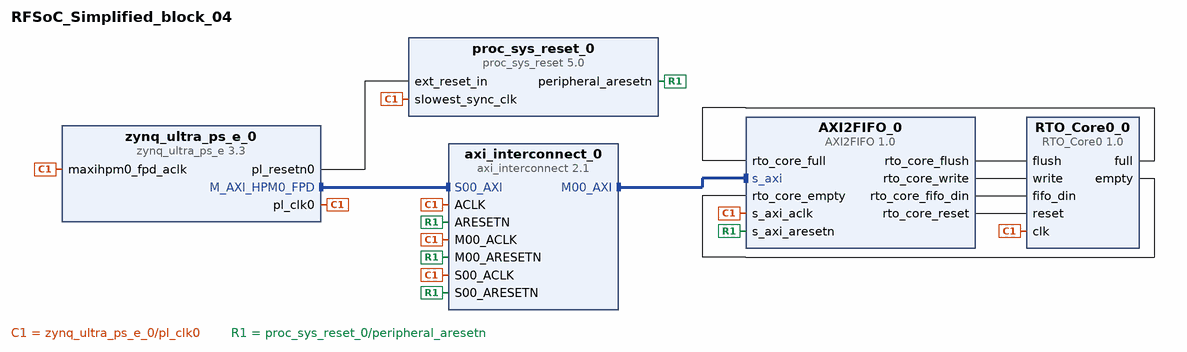
[diagram p0: block diagram of the top level]
# Vivado block design RFSoC_Simplified_block_04, xczu28dr-ffvg1517-2-e, Vivado 2020.2
create_bd_design RFSoC_Simplified_block_04

create_bd_cell -type ip -vlnv xilinx.com:ip:zynq_ultra_ps_e:3.3 zynq_ultra_ps_e_0
set_property -dict [list \
  CONFIG.PSU__DDR_HIGH_ADDRESS_GUI_ENABLE 0 \
  CONFIG.PSU__MAXIGP0__DATA_WIDTH 128 \
  CONFIG.PSU__USE__M_AXI_GP0 1 \
  CONFIG.PSU__USE__M_AXI_GP2 0 \
] [get_bd_cells zynq_ultra_ps_e_0]
# 2 more settings of zynq_ultra_ps_e_0 are not shown: defaults, MIO pin electricals, DDR timing, and values the tool derives
create_bd_cell -type ip -vlnv xilinx.com:ip:axi_interconnect:2.1 axi_interconnect_0
set_property -dict {CONFIG.NUM_MI 1} [get_bd_cells axi_interconnect_0]
create_bd_cell -type ip -vlnv xilinx.com:ip:proc_sys_reset:5.0 proc_sys_reset_0
create_bd_cell -type ip -vlnv xilinx.com:user:AXI2FIFO:1.0 AXI2FIFO_0
create_bd_cell -type ip -vlnv xilinx.com:user:RTO_Core0:1.0 RTO_Core0_0

# ---- connections ----

connect_bd_intf_net [get_bd_intf_pins zynq_ultra_ps_e_0/M_AXI_HPM0_FPD] [get_bd_intf_pins axi_interconnect_0/S00_AXI]
connect_bd_intf_net [get_bd_intf_pins axi_interconnect_0/M00_AXI] [get_bd_intf_pins AXI2FIFO_0/s_axi]
connect_bd_net [get_bd_pins zynq_ultra_ps_e_0/pl_clk0] \
  [get_bd_pins RTO_Core0_0/clk] [get_bd_pins AXI2FIFO_0/s_axi_aclk] [get_bd_pins axi_interconnect_0/M00_ACLK] \
  [get_bd_pins proc_sys_reset_0/slowest_sync_clk] [get_bd_pins axi_interconnect_0/ACLK] \
  [get_bd_pins axi_interconnect_0/S00_ACLK] [get_bd_pins zynq_ultra_ps_e_0/maxihpm0_fpd_aclk]
connect_bd_net [get_bd_pins AXI2FIFO_0/rto_core_flush] [get_bd_pins RTO_Core0_0/flush]
connect_bd_net [get_bd_pins AXI2FIFO_0/rto_core_write] [get_bd_pins RTO_Core0_0/write]
connect_bd_net [get_bd_pins AXI2FIFO_0/rto_core_fifo_din] [get_bd_pins RTO_Core0_0/fifo_din]
connect_bd_net [get_bd_pins RTO_Core0_0/full] [get_bd_pins AXI2FIFO_0/rto_core_full]
connect_bd_net [get_bd_pins RTO_Core0_0/empty] [get_bd_pins AXI2FIFO_0/rto_core_empty]
connect_bd_net [get_bd_pins AXI2FIFO_0/rto_core_reset] [get_bd_pins RTO_Core0_0/reset]
connect_bd_net [get_bd_pins proc_sys_reset_0/peripheral_aresetn] \
  [get_bd_pins AXI2FIFO_0/s_axi_aresetn] [get_bd_pins axi_interconnect_0/M00_ARESETN] \
  [get_bd_pins axi_interconnect_0/ARESETN] [get_bd_pins axi_interconnect_0/S00_ARESETN]
connect_bd_net [get_bd_pins zynq_ultra_ps_e_0/pl_resetn0] [get_bd_pins proc_sys_reset_0/ext_reset_in]

# ---- address map ----
assign_bd_address -offset 0x00A0000000 -range 4K -target_address_space [get_bd_addr_spaces zynq_ultra_ps_e_0/Data] [get_bd_addr_segs AXI2FIFO_0/s_axi/reg0]

validate_bd_design
save_bd_design
